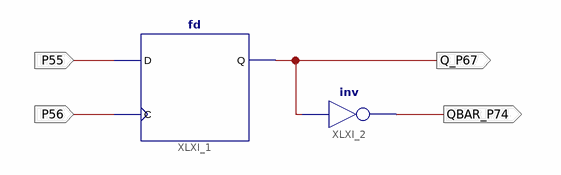
[diagram p0: schematic sheet 1]
// Xilinx ISE schematic test.sch (spartan6) as structural Verilog: 2 symbols, 4 ports
module test (
  input  P55,
  input  P56,
  output Q_P67,
  output QBAR_P74
);

  fd XLXI_1 (.C(P56), .D(P55), .Q(Q_P67));
  not XLXI_2 (QBAR_P74, Q_P67);
endmodule
